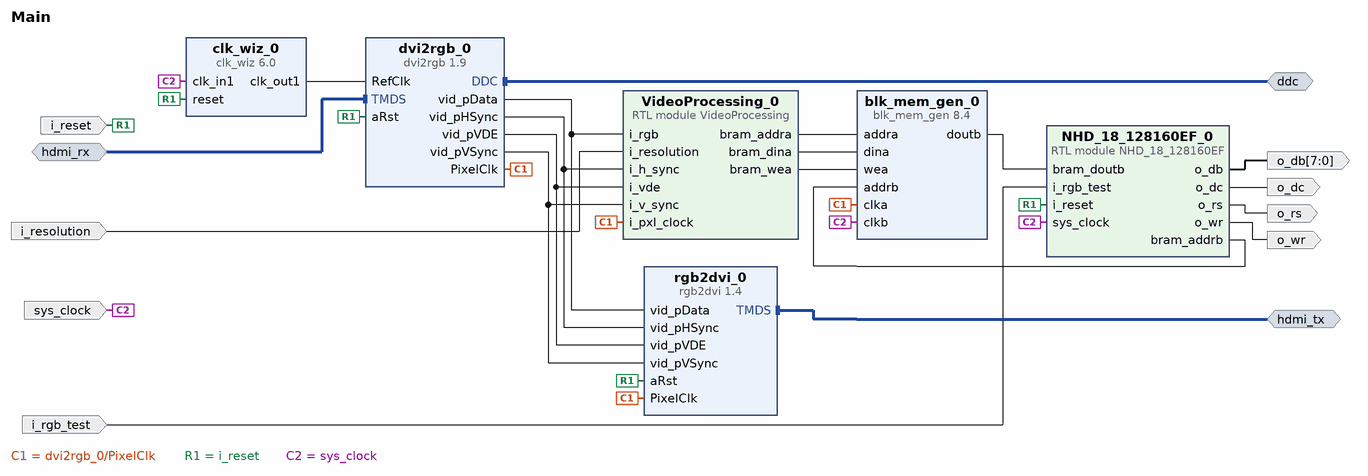
[diagram p0: block diagram of the top level]
# Vivado block design Main, xc7z020clg400-1, Vivado 2018.1
create_bd_design Main

create_bd_intf_port -mode Master -vlnv xilinx.com:interface:iic_rtl:1.0 ddc
create_bd_intf_port -mode Slave -vlnv digilentinc.com:interface:tmds_rtl:1.0 hdmi_rx
create_bd_intf_port -mode Master -vlnv digilentinc.com:interface:tmds_rtl:1.0 hdmi_tx
create_bd_port -dir O o_dc
create_bd_port -dir O o_rs
create_bd_port -dir O o_wr
create_bd_port -dir I -type rst i_reset
set_property -dict {CONFIG.POLARITY ACTIVE_HIGH} [get_bd_ports i_reset]
create_bd_port -dir I i_resolution
create_bd_port -dir I i_rgb_test
create_bd_port -dir I -type clk sys_clock
set_property -dict {CONFIG.FREQ_HZ 125000000 CONFIG.PHASE 0.000} [get_bd_ports sys_clock]
create_bd_port -dir O -from 7 -to 0 o_db

create_bd_cell -type ip -vlnv xilinx.com:ip:blk_mem_gen:8.4 blk_mem_gen_0
set_property -dict [list \
  CONFIG.Memory_Type Simple_Dual_Port_RAM \
  CONFIG.Enable_32bit_Address false \
  CONFIG.Use_Byte_Write_Enable false \
  CONFIG.Assume_Synchronous_Clk false \
  CONFIG.Write_Width_A 24 \
  CONFIG.Write_Depth_A 20480 \
  CONFIG.Operating_Mode_A NO_CHANGE \
  CONFIG.Enable_A Always_Enabled \
  CONFIG.Write_Width_B 24 \
  CONFIG.Read_Width_B 24 \
  CONFIG.Enable_B Always_Enabled \
  CONFIG.Register_PortB_Output_of_Memory_Primitives false \
  CONFIG.Port_B_Clock 100 \
  CONFIG.Port_B_Enable_Rate 100 \
  CONFIG.use_bram_block Stand_Alone \
] [get_bd_cells blk_mem_gen_0]
create_bd_cell -type ip -vlnv xilinx.com:ip:clk_wiz:6.0 clk_wiz_0
set_property -dict [list \
  CONFIG.CLKOUT1_REQUESTED_OUT_FREQ 200.000 \
  CONFIG.MMCM_DIVCLK_DIVIDE 1 \
  CONFIG.MMCM_CLKOUT0_DIVIDE_F 5.000 \
  CONFIG.USE_BOARD_FLOW true \
  CONFIG.CLK_IN1_BOARD_INTERFACE sys_clock \
  CONFIG.CLKOUT1_JITTER 109.241 \
] [get_bd_cells clk_wiz_0]
create_bd_cell -type ip -vlnv digilentinc.com:ip:dvi2rgb:1.9 dvi2rgb_0
set_property -dict [list \
  CONFIG.kEmulateDDC true \
  CONFIG.kEnableSerialClkOutput false \
  CONFIG.kRstActiveHigh true \
  CONFIG.kClkRange 1 \
  CONFIG.kEdidFileName dgl_720p_cea.data \
  CONFIG.IIC_BOARD_INTERFACE i2c \
] [get_bd_cells dvi2rgb_0]
create_bd_cell -type ip -vlnv digilentinc.com:ip:rgb2dvi:1.4 rgb2dvi_0
set_property -dict {CONFIG.kClkPrimitive MMCM CONFIG.kClkRange 1} [get_bd_cells rgb2dvi_0]
create_bd_cell -type module -reference VideoProcessing VideoProcessing_0
create_bd_cell -type module -reference NHD_18_128160EF NHD_18_128160EF_0

# ---- connections ----

connect_bd_intf_net [get_bd_intf_ports ddc] [get_bd_intf_pins dvi2rgb_0/DDC]
connect_bd_intf_net -intf_net TMDS_0_1 [get_bd_intf_ports hdmi_rx] [get_bd_intf_pins dvi2rgb_0/TMDS]
connect_bd_intf_net [get_bd_intf_ports hdmi_tx] [get_bd_intf_pins rgb2dvi_0/TMDS]
connect_bd_net [get_bd_pins VideoProcessing_0/bram_addra] [get_bd_pins blk_mem_gen_0/addra]
connect_bd_net [get_bd_pins VideoProcessing_0/bram_dina] [get_bd_pins blk_mem_gen_0/dina]
connect_bd_net -net VideoProcessing_0_bram_en [get_bd_pins VideoProcessing_0/bram_wea] [get_bd_pins blk_mem_gen_0/wea]
connect_bd_net [get_bd_pins clk_wiz_0/clk_out1] [get_bd_pins dvi2rgb_0/RefClk]
connect_bd_net [get_bd_pins dvi2rgb_0/PixelClk] \
  [get_bd_pins blk_mem_gen_0/clka] [get_bd_pins rgb2dvi_0/PixelClk] [get_bd_pins VideoProcessing_0/i_pxl_clock]
connect_bd_net [get_bd_pins dvi2rgb_0/vid_pData] [get_bd_pins rgb2dvi_0/vid_pData] [get_bd_pins VideoProcessing_0/i_rgb]
connect_bd_net [get_bd_pins dvi2rgb_0/vid_pHSync] [get_bd_pins rgb2dvi_0/vid_pHSync] [get_bd_pins VideoProcessing_0/i_h_sync]
connect_bd_net [get_bd_pins dvi2rgb_0/vid_pVDE] [get_bd_pins rgb2dvi_0/vid_pVDE] [get_bd_pins VideoProcessing_0/i_vde]
connect_bd_net [get_bd_pins dvi2rgb_0/vid_pVSync] [get_bd_pins rgb2dvi_0/vid_pVSync] [get_bd_pins VideoProcessing_0/i_v_sync]
connect_bd_net [get_bd_ports i_reset] \
  [get_bd_pins clk_wiz_0/reset] [get_bd_pins dvi2rgb_0/aRst] [get_bd_pins rgb2dvi_0/aRst] \
  [get_bd_pins NHD_18_128160EF_0/i_reset]
connect_bd_net -net i_resolution_0_1 [get_bd_ports i_resolution] [get_bd_pins VideoProcessing_0/i_resolution]
connect_bd_net [get_bd_ports sys_clock] [get_bd_pins blk_mem_gen_0/clkb] [get_bd_pins clk_wiz_0/clk_in1] [get_bd_pins NHD_18_128160EF_0/sys_clock]
connect_bd_net [get_bd_pins NHD_18_128160EF_0/o_wr] [get_bd_ports o_wr]
connect_bd_net [get_bd_pins NHD_18_128160EF_0/o_dc] [get_bd_ports o_dc]
connect_bd_net [get_bd_pins NHD_18_128160EF_0/o_rs] [get_bd_ports o_rs]
connect_bd_net [get_bd_pins NHD_18_128160EF_0/bram_addrb] [get_bd_pins blk_mem_gen_0/addrb]
connect_bd_net [get_bd_ports i_rgb_test] [get_bd_pins NHD_18_128160EF_0/i_rgb_test]
connect_bd_net [get_bd_pins blk_mem_gen_0/doutb] [get_bd_pins NHD_18_128160EF_0/bram_doutb]
connect_bd_net [get_bd_pins NHD_18_128160EF_0/o_db] [get_bd_ports o_db]

validate_bd_design
save_bd_design
